# Altium schematic sheet Sheet1.SchDoc
size A3
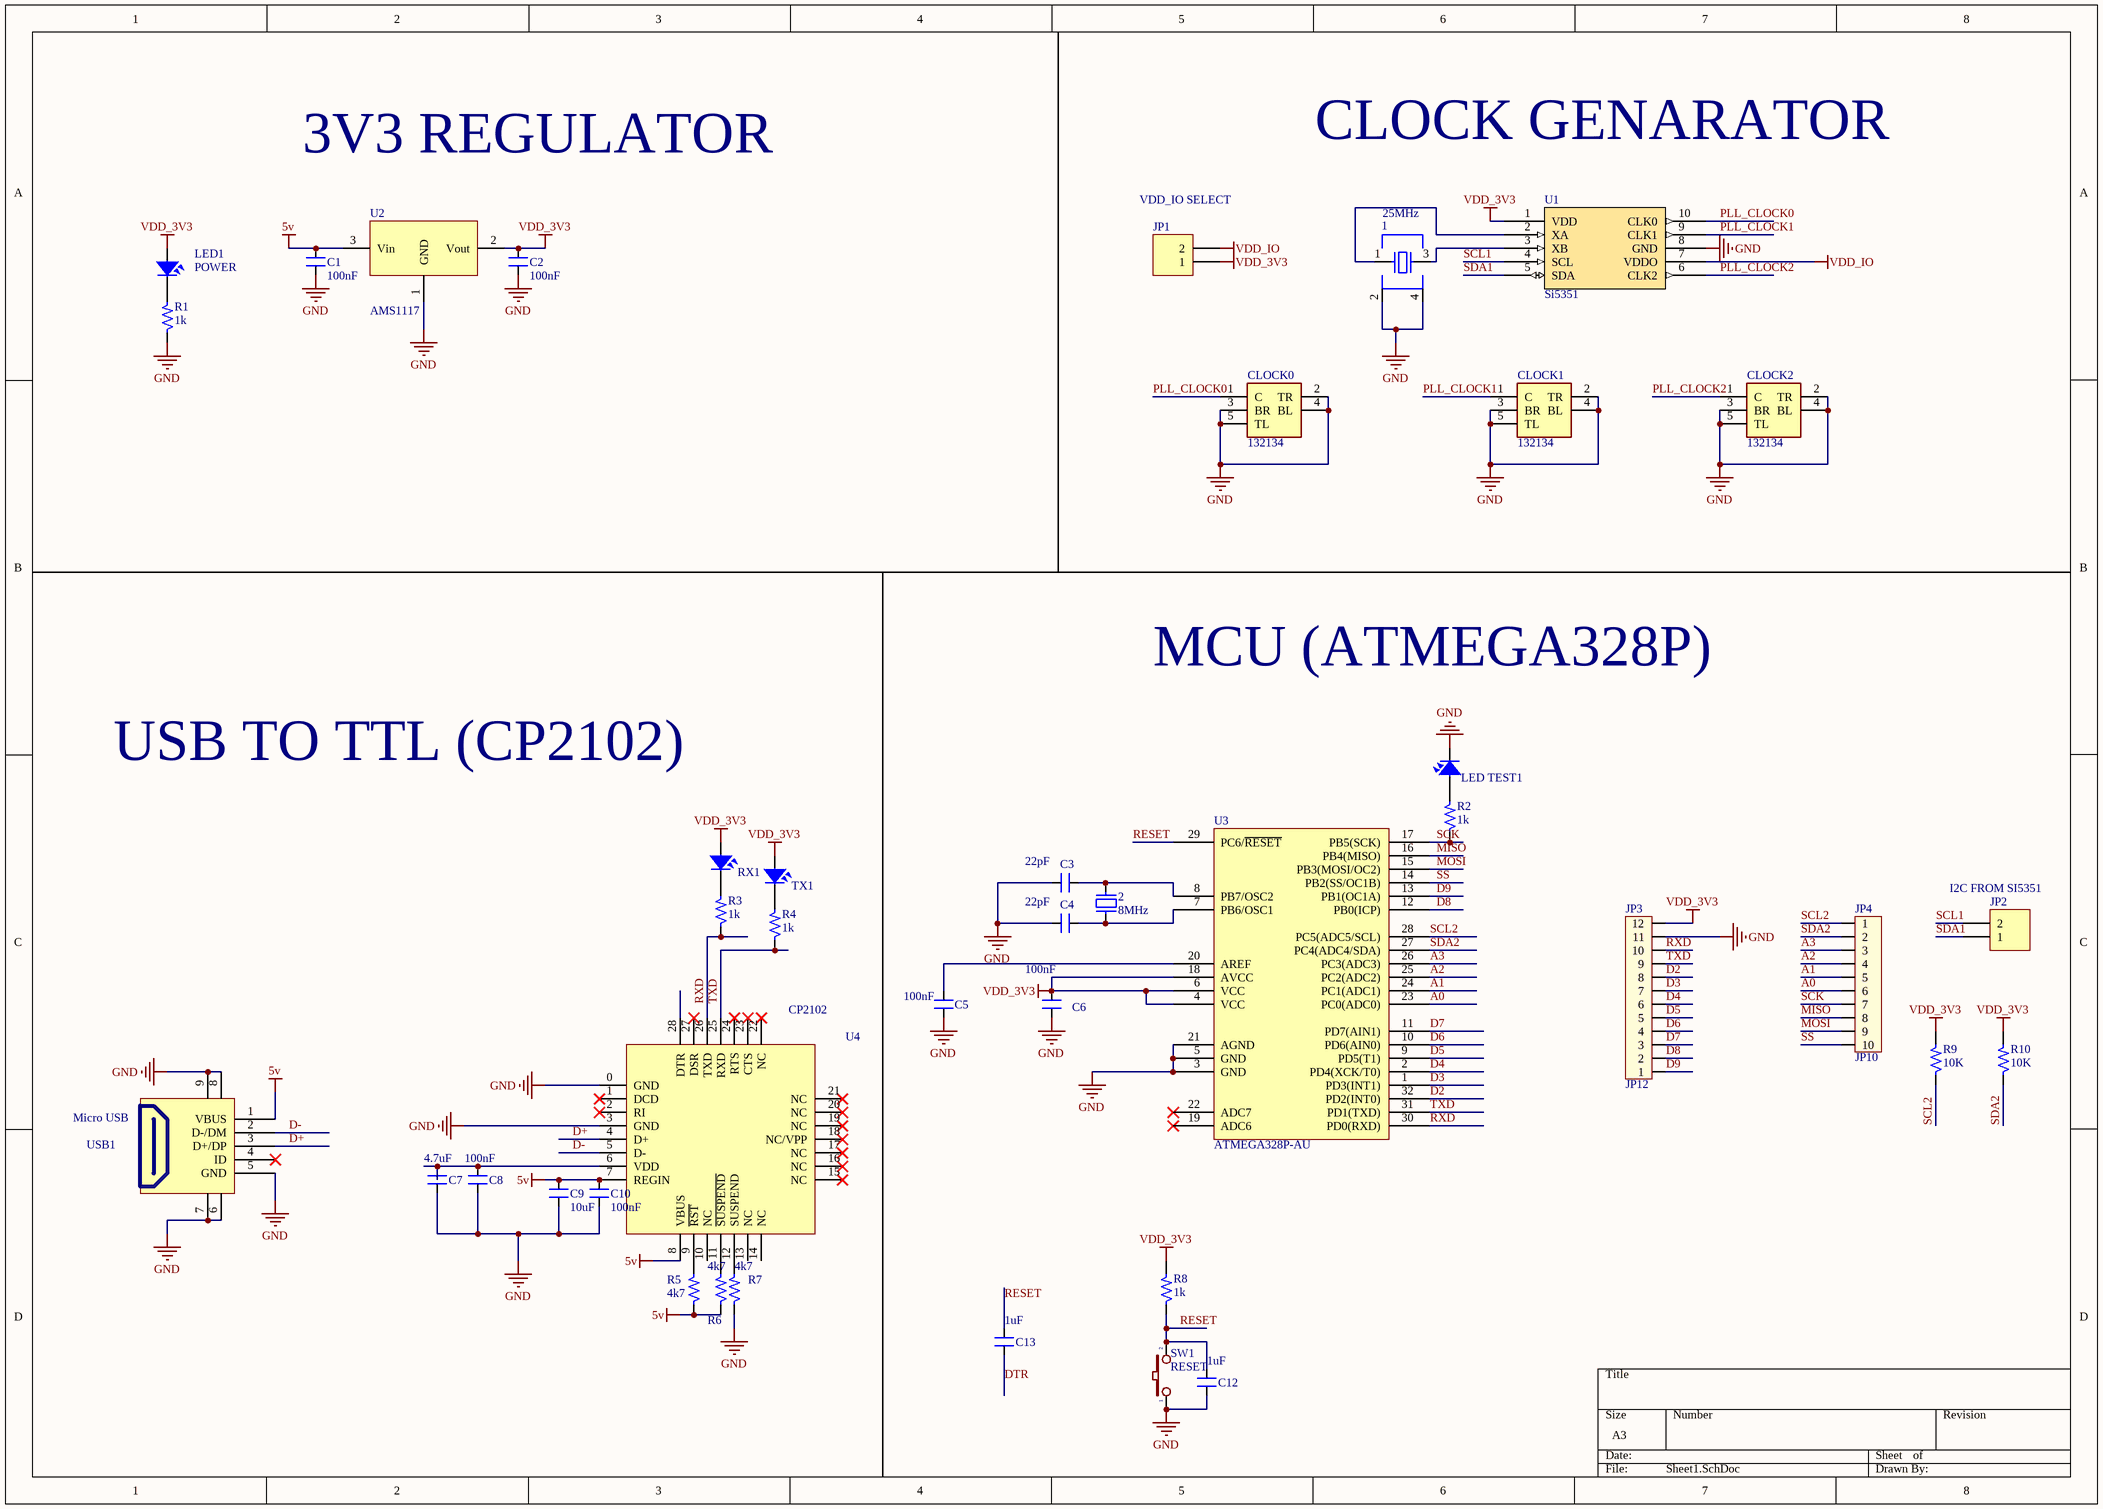
[diagram p0: Sheet1.SchDoc]

## Parts
1  25MHz  [XT4-3.2x2.5]
2  8MHz  [XT 5032]
C1  100nF  [0603_cap]
C2  100nF  [0603_cap]
C3  22pF  [0603_cap]
C4  22pF  [0603_cap]
C5  100nF  [0603_cap]
C6  100nF  [0603_cap]
C7  100nF  [0603_cap]
C8  4.7uF  [0603_cap]
C9  10uF  [0603_cap]
C10  100nF  [0603_cap]
C12  1uF  [0603_cap]
C13  1uF  [0603_cap]
CLOCK0  132134  [SMA-132322]
CLOCK1  132134  [SMA-132322]
CLOCK2  132134  [SMA-132322]
JP1  Header 2  [JP2-D1T]  (value not drawn)
JP2  Header 2  [JP2-D1T]  (value not drawn)
JP3  JP12  [JP12-D1T]
JP4  JP10  [JP10-D1T]
LED1  POWER  [0603_LED]
LED_TEST1  LED SMD  [0603_LED]  (value not drawn)
R1  1k  [0603_res]
R2  1k  [0603_res]
R3  1k  [0603_res]
R4  1k  [0603_res]
R5  4k7  [0603_res]
R6  4k7  [0603_res]
R7  4k7  [0603_res]
R8  1k  [0603_res]
R9  10K  [0603_res]
R10  10K  [0603_res]
RX1  LED SMD  [0603_LED]  (value not drawn)
SW1  RESET  [SW-SMD]
TX1  LED SMD  [0603_LED]  (value not drawn)
U1  Si5351  [MSOP10_L]
U2  AMS1117  [SOT223_N]
U3  ATMEGA328P-AU  [QFP7X7-G32/X.45N]
U4  CP2102  [QFN28 - 9]
USB1  Micro USB  [MICROUSB - v2]

## Nets
5v: C1.2 C9.2 C10.2 R5.1 R6.1 U2.3(Vin) U4.7(REGIN) U4.8(VBUS) USB1.1(VBUS)
GND: 1.2 1.4 C1.1 C2.1 C3.2 C4.2 C5.1 C6.1 C7.2 C8.1 C9.1 C10.1 C12.1 CLOCK0.2(TR) CLOCK0.3(BR) CLOCK0.4(BL) CLOCK0.5(TL) CLOCK1.2(TR) CLOCK1.3(BR) CLOCK1.4(BL) CLOCK1.5(TL) CLOCK2.2(TR) CLOCK2.3(BR) CLOCK2.4(BL) CLOCK2.5(TL) JP3.11 LED_TEST1.2 R1.1 R7.1 SW1.1 U1.8(GND) U2.1(GND) U3.3(GND) U3.5(GND) U3.21(AGND) U4.0(GND) U4.3(GND) USB1.5(GND) USB1.6(SH) USB1.7(SH) USB1.8(SH) USB1.9(SH)
VDD_3V3: C2.2 C6.2 JP1.1 JP3.12 LED1.1 R8.2 R9.2 R10.2 RX1.1 TX1.1 U1.1(VDD) U2.2(Vout) U3.4(VCC) U3.6(VCC) U3.18(AVCC)
VDD_IO: JP1.2 U1.7(VDDO)
A0: JP4.6 U3.23(PC0(ADC0))
A1: JP4.5 U3.24(PC1(ADC1))
A2: JP4.4 U3.25(PC2(ADC2))
A3: JP4.3 U3.26(PC3(ADC3))
D2: JP3.8 U3.32(PD2(INT0))
D3: JP3.7 U3.1(PD3(INT1))
D4: JP3.6 U3.2(PD4(XCK/T0))
D5: JP3.5 U3.9(PD5(T1))
D6: JP3.4 U3.10(PD6(AIN0))
D7: JP3.3 U3.11(PD7(AIN1))
D8: JP3.2 U3.12(PB0(ICP))
D9: JP3.1 U3.13(PB1(OC1A))
D+: U4.4(D+) USB1.3(D+/DP)
D-: U4.5(D-) USB1.2(D-/DM)
DTR: C13.1
MISO: JP4.8 U3.16(PB4(MISO))
MOSI: JP4.9 U3.15(PB3(MOSI/OC2))
PLL_CLOCK0: CLOCK0.1(C) U1.10(CLK0)
PLL_CLOCK1: CLOCK1.1(C) U1.9(CLK1)
PLL_CLOCK2: CLOCK2.1(C) U1.6(CLK2)
RESET: C12.2 C13.2 R8.1 SW1.2 U3.29(PC6/~{RESET})
RXD: JP3.10 R3.1 U3.30(PD0(RXD)) U4.26(TXD)
SCK: JP4.7 R2.1 U3.17(PB5(SCK))
SCL1: JP2.2 U1.4(SCL)
SCL2: JP4.1 R9.1 U3.28(PC5(ADC5/SCL))
SDA1: JP2.1 U1.5(SDA)
SDA2: JP4.2 R10.1 U3.27(PC4(ADC4/SDA))
SS: JP4.10 U3.14(PB2(SS/OC1B))
TXD: JP3.9 R4.1 U3.31(PD1(TXD)) U4.25(RXD)
Net1_1: 1.1 U1.2(XA)
Net1_3: 1.3 U1.3(XB)
Net2_1: 2.1 C4.1 U3.7(PB6/OSC1)
Net2_2: 2.2 C3.1 U3.8(PB7/OSC2)
NetC5_2: C5.2 U3.20(AREF)
NetC7_1: C7.1 C8.2 U4.6(VDD)
NetLED1_2: LED1.2 R1.2
NetLED_TEST1_1: LED_TEST1.1 R2.2
NetR3_2: R3.2 RX1.2
NetR4_2: R4.2 TX1.2
NetR5_2: R5.2 U4.9(~{RST})
NetR6_2: R6.2 U4.11(~{SUSPEND})
NetR7_2: R7.2 U4.12(SUSPEND)

Not connected (* = marked no-connect by the designer): U3 19(ADC6)* 22(ADC7)*; U4 1(DCD)* 2(RI)* 10(NC) 13(NC) 14(NC) 15(NC)* 16(NC)* 17(NC)* 18(NC/VPP)* 19(NC)* 20(NC)* 21(NC)* 22(NC)* 23(CTS)* 24(RTS)* 27(DSR)* 28(DTR); USB1 4(ID)*

## Notes on the sheet
- 3V3 REGULATOR
- CLOCK GENARATOR
- (near JP1) VDD_IO SELECT
- MCU (ATMEGA328P)
- USB TO TTL (CP2102)
- (near JP2) I2C FROM SI5351

## Library data of the parts
1 = XT4_SMD: 4 pin crystal surface mount
2 = XT455k: Crystal 455kHz Infrared; Value: 32,768khz
C1-C10 C12 C13 = CN4: Cap np W0.4; Value: 0.47uF
CLOCK0-CLOCK2 = 132134: SMA Connector - STRAIGHT JACK FOR P.C. BOARD - Female
JP1 JP2 = Header 2: Header, 2-Pin; Manufacturer: Generic Components; Class: Connector; Value: Header 2
JP3 = Con12: Connector 12; Value: Connector 12
JP4 = Con10: Connector 10; Value: Connector 10
LED1 LED_TEST1 RX1 TX1 = LED-SMD-0603: Manufacture: *; Unit Price: *; Value: *
R1-R10 = R: Resistor 1/4W; Value: R1/4W - 1K; Manufacture: *; Part Number: *; Unit Price: *
SW1 = SW2: Switch button 2 pin; Value: SW chip 2 pin
U1 = Si5351: I2C-PROGRAMMABLE ANY-FREQUENCY CMOS CLOCK
U3 = ATMEGA328P-AU: 8-bit AVR Microcontrollers
U4 = CP2102: SINGLE-CHIP USB-TO-UART BRIDGE
USB1 = USB Micro